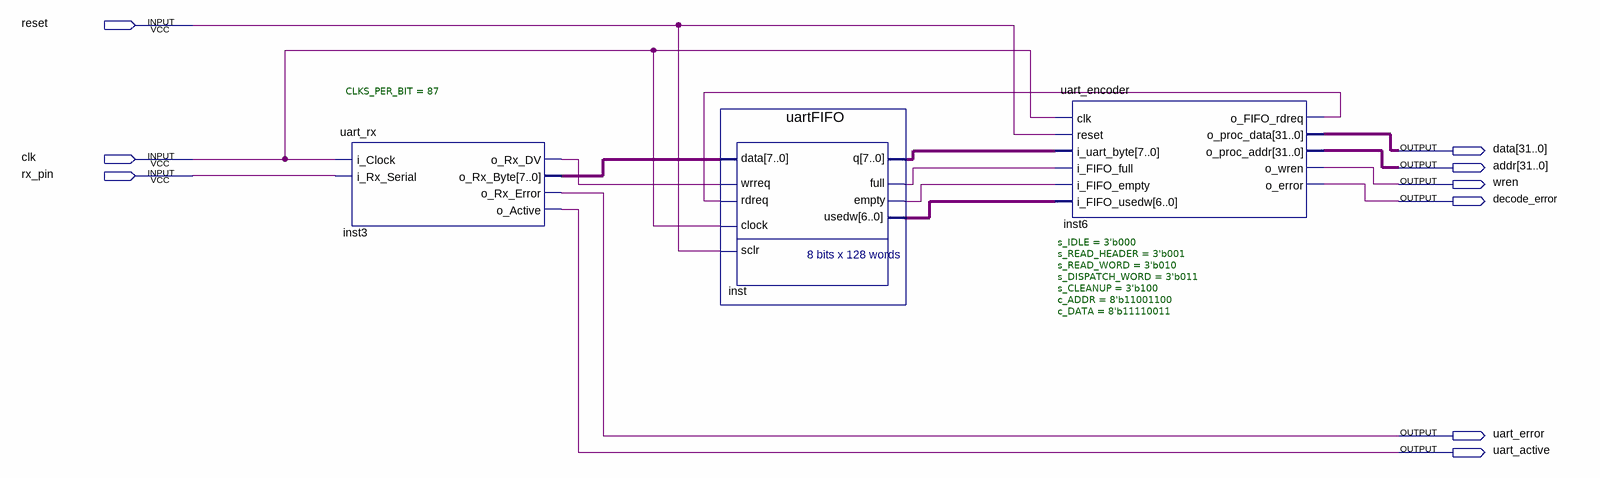
[diagram p0: schematic sheet]
// Quartus schematic uart_loader.bdf as structural Verilog: 3 symbols, 9 pins
module uart_loader (
  input  reset,
  input  clk,
  input  rx_pin,
  output [31:0] data,
  output [31:0] addr,
  output wren,
  output decode_error,
  output uart_error,
  output uart_active
);

  wire inst3_o_rx_dv, inst6_o_fifo_rdreq, inst_empty, inst_full;
  wire [6:0] inst_usedw;
  wire [7:0] inst3_o_rx_byte, inst_q;

  uart_rx #(.CLKS_PER_BIT(87)) inst3 (
    .i_Clock(clk), .i_Rx_Serial(rx_pin), .o_Rx_DV(inst3_o_rx_dv), .o_Rx_Byte(inst3_o_rx_byte),
    .o_Rx_Error(uart_error), .o_Active(uart_active));
  uartFIFO inst (
    .data(inst3_o_rx_byte), .wrreq(inst3_o_rx_dv), .rdreq(inst6_o_fifo_rdreq), .clock(clk), .sclr(reset),
    .q(inst_q), .full(inst_full), .empty(inst_empty), .usedw(inst_usedw));
  uart_encoder #(.s_IDLE(3'b000), .s_READ_HEADER(3'b001), .s_READ_WORD(3'b010), .s_DISPATCH_WORD(3'b011), .s_CLEANUP(3'b100), .c_ADDR(8'b11001100), .c_DATA(8'b11110011)) inst6 (
    .clk(clk), .reset(reset), .i_uart_byte(inst_q), .i_FIFO_full(inst_full), .i_FIFO_empty(inst_empty),
    .i_FIFO_usedw(inst_usedw), .o_FIFO_rdreq(inst6_o_fifo_rdreq), .o_proc_data(data), .o_proc_addr(addr),
    .o_wren(wren), .o_error(decode_error));
endmodule
